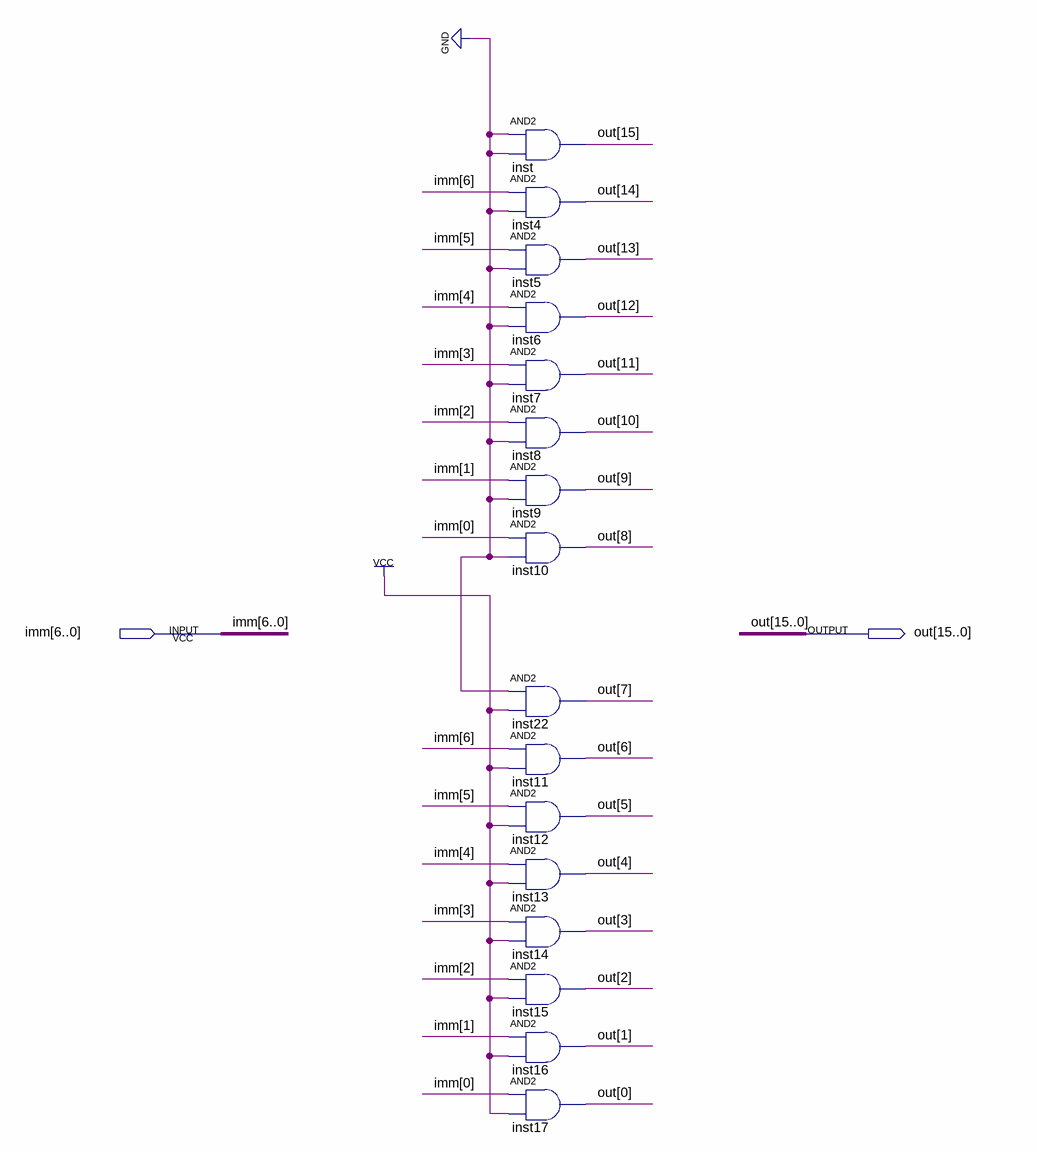
[diagram p0: schematic sheet]
// Quartus schematic Send_Imm.bdf as structural Verilog: 16 symbols, 2 pins
module Send_Imm (
  input  [6:0] imm,
  output [15:0] out
);

  and inst (out[15], 1'b0, 1'b0);
  and inst4 (out[14], imm[6], 1'b0);
  and inst5 (out[13], imm[5], 1'b0);
  and inst6 (out[12], imm[4], 1'b0);
  and inst7 (out[11], imm[3], 1'b0);
  and inst8 (out[10], imm[2], 1'b0);
  and inst9 (out[9], imm[1], 1'b0);
  and inst10 (out[8], imm[0], 1'b0);
  and inst22 (out[7], 1'b0, 1'b1);
  and inst11 (out[6], imm[6], 1'b1);
  and inst12 (out[5], imm[5], 1'b1);
  and inst13 (out[4], imm[4], 1'b1);
  and inst14 (out[3], imm[3], 1'b1);
  and inst15 (out[2], imm[2], 1'b1);
  and inst16 (out[1], imm[1], 1'b1);
  and inst17 (out[0], imm[0], 1'b1);
endmodule
